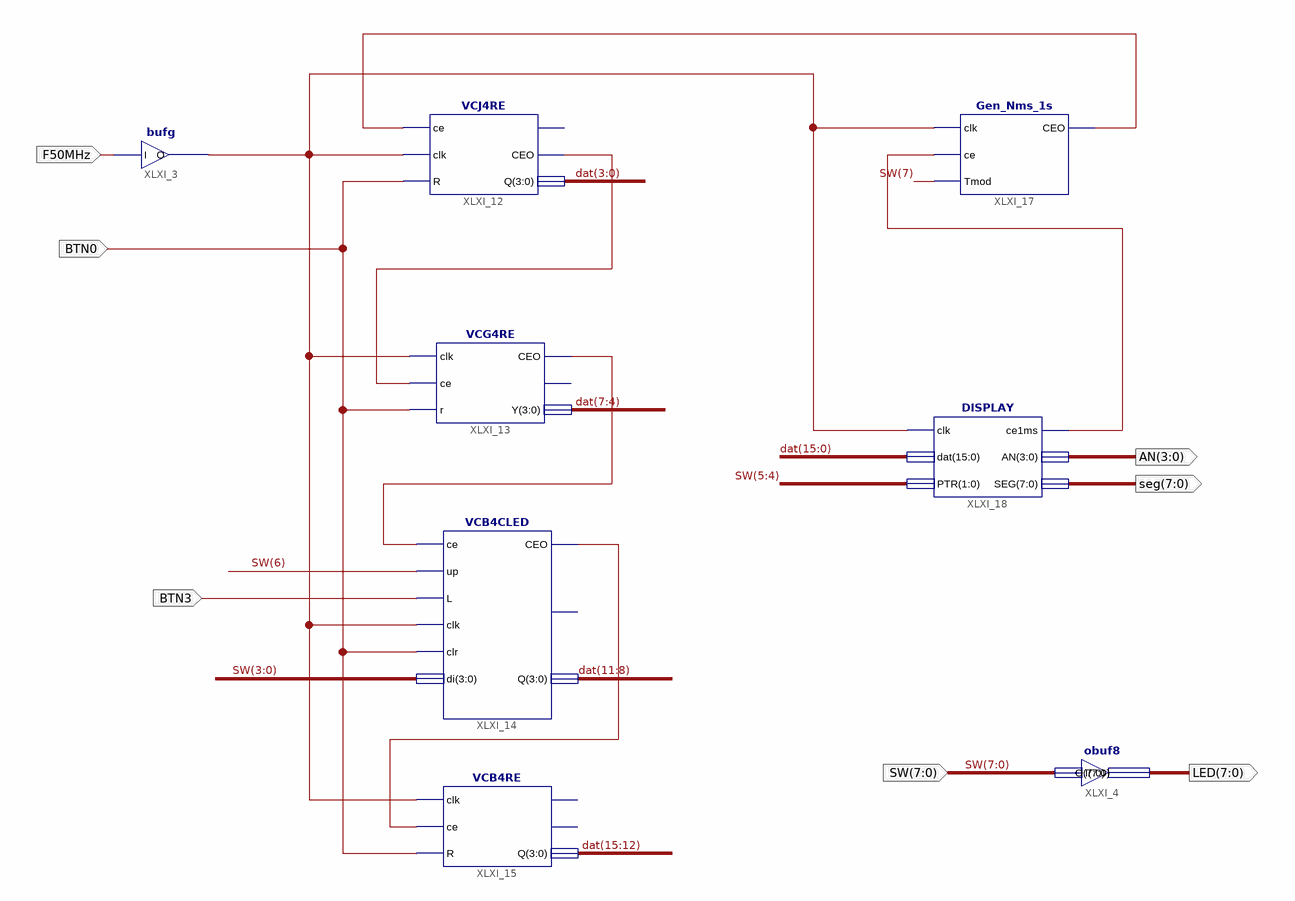
[diagram p0: schematic sheet 1]
// Xilinx ISE schematic sch_example.sch (spartan3e) as structural Verilog: 8 symbols, 7 ports
module sch_example (
  input  F50MHz,
  input  BTN0,
  input  BTN3,
  input  [7:0] SW,
  output [7:0] LED,
  output [3:0] AN,
  output [7:0] seg
);

  wire XLXN_1, XLXN_2, XLXN_3, XLXN_4, XLXN_11, XLXN_17;
  wire [15:0] dat;

  bufg XLXI_3 (.I(F50MHz), .O(XLXN_11));
  obuf8 XLXI_4 (.I(SW), .O(LED));
  VCJ4RE XLXI_12 (.ce(XLXN_1), .clk(XLXN_11), .R(BTN0), .CEO(XLXN_2), .Q(dat[3:0]));  // open: TC
  VCG4RE XLXI_13 (.clk(XLXN_11), .ce(XLXN_2), .r(BTN0), .CEO(XLXN_3), .Y(dat[7:4]));  // open: TC
  VCB4CLED XLXI_14 (
    .ce(XLXN_3), .up(SW[6]), .L(BTN3), .clk(XLXN_11), .clr(BTN0), .di(SW[3:0]), .CEO(XLXN_4), .Q(dat[11:8]));  // open: TC
  VCB4RE XLXI_15 (.ce(XLXN_4), .clk(XLXN_11), .R(BTN0), .Q(dat[15:12]));  // open: TC, CEO
  Gen_Nms_1s XLXI_17 (.clk(XLXN_11), .ce(XLXN_17), .Tmod(SW[7]), .CEO(XLXN_1));
  DISPLAY XLXI_18 (.clk(XLXN_11), .dat(dat), .PTR(SW[5:4]), .ce1ms(XLXN_17), .AN(AN), .SEG(seg));
endmodule
